# EasyEDA Pro project 2025_07_18_imu.epro

# Schematic Schematic1
Board Name: Board1; Create Date: 2025-07-18; Page Name: P1; Project Name: 2025_07_18_imu; Schematic Name: Schematic1; Update Date: 2025-07-18; Company: EasyEDA.com; Page Size: A4; Version: V1.0
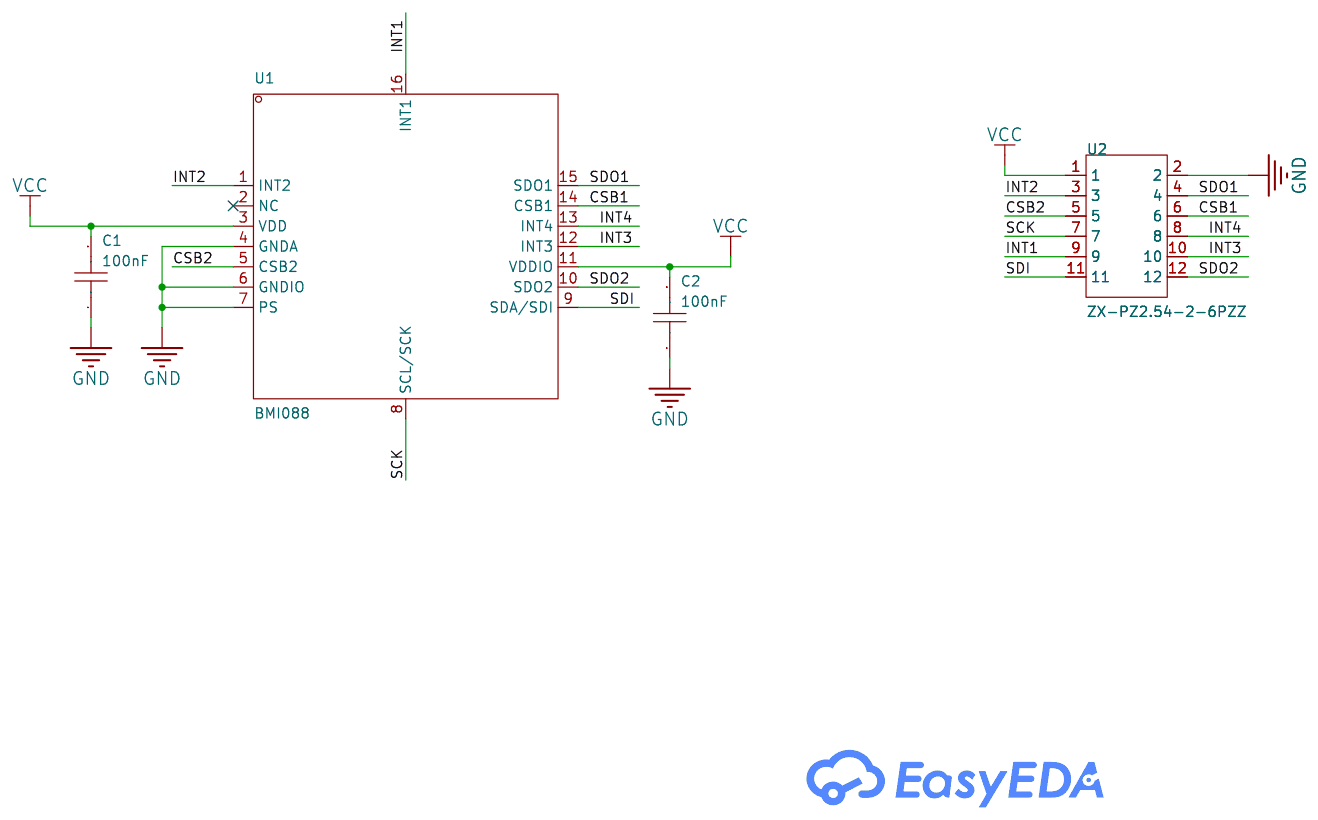
[diagram p0: schematic sheet]

## Parts
C1  100nF  [C0402]
C2  100nF  [C0402]
U1  BMI088  [LGA-16_L4.5-W3.0-P0.50-BL]
U2  ZX-PZ2.54-2-6PZZ  [HDR-TH_12P-P2.54-V-M-R2-C6-S2.54]

## Library data of the parts
C1 C2 = CL05B104KO5NNNC: Capacitance: Tolerance:±10% Tolerance:±10% Voltage Rated: Temperature Coefficient:; LCSC Part Name: 100nF ±10% 16V; Supplier Part: C1525; Manufacturer: SAMSUNG(三星); Supplier Footprint: 0402; JLCPCB Part Class: Basic Part; Datasheet: https://atta.szlcsc.com/upload/public/pdf/source/20160218/1457707763339.pdf; Supplier: LCSC; Tolerance: ±10%
U1 = BMI088: Sensor Type:加速度计陀螺仪 Operating Temperature:-40℃~+85℃ Operating Temperature:-40℃~+85℃; Supplier Part: C194919; Manufacturer: Bosch(博世); Supplier Footprint: LGA-16(3x4.5); JLCPCB Part Class: Extended Part; Datasheet: https://atta.szlcsc.com/upload/public/pdf/source/20180628/C194919_66CCF125FF968C218A4D358C68AC68D6.pdf; Supplier: LCSC; Sensor Type: 加速度计陀螺仪; Operating Temperature: -40℃~+85℃
U2 = ZX-PZ2.54-2-6PZZ: Pin Structure:2x6P Pitch:2.54mm Row Spacing:2.54mm Circluar Pins/Square Pins:Policy Mounting Type:Straight Number of Rows:Double Row Number of Pins:12P Current Rating:3A Voltage Rating (Max):1kV Length of Mating Pin:6mm Insulation Height:2.5mm Length of E; LCSC Part Name: 2x6P 间距:2.54mm 方针 直插; Supplier Part: C7501277; Manufacturer: Megastar(兆星); Supplier Footprint: 插件,P=2.54mm; JLCPCB Part Class: Extended Part; Datasheet: https://atta.szlcsc.com/upload/public/pdf/source/20231122/7E8446F7D73762EB4E85E59BCD5E7B5B.pdf; Supplier: LCSC; Pin Structure: 2x6P; Pitch: 2.54mm; Row Spacing: 2.54mm; Circluar Pins/Square Pins: Policy; Mounting Type: Straight; Number of Rows: Double Row; Number of Pins: 12P; Current Rating: 3A; Voltage Rating (Max): 1kV; Length of Mating Pin: 6mm; Insulation Height: 2.5mm; Length of End Connection Pin: 3mm; Contact Material: Brass; Contact Plating: Gold; Operating Temperature: -40℃~+105℃; Color: Black

## Nets
GND: C1.1 C2.1 U1.4(GNDA) U1.6(GNDIO) U1.7(PS) U2.2
VCC: C1.2 C2.2 U1.3(VDD) U1.11(VDDIO) U2.1
CSB1: U1.14(CSB1) U2.6
CSB2: U1.5(CSB2) U2.5
INT1: U1.16(INT1) U2.9
INT2: U1.1(INT2) U2.3
INT3: U1.12(INT3) U2.10
INT4: U1.13(INT4) U2.8
SCK: U1.8(SCL/SCK) U2.7
SDI: U1.9(SDA/SDI) U2.11
SDO1: U1.15(SDO1) U2.4
SDO2: U1.10(SDO2) U2.12

Not connected (* = marked no-connect by the designer): U1 2(NC)*

# Board PCB1
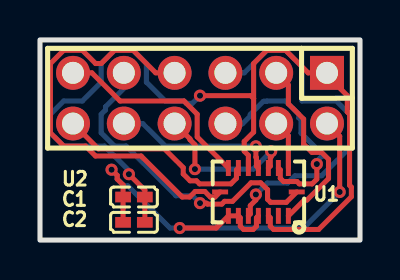
[diagram p1: board, top side]
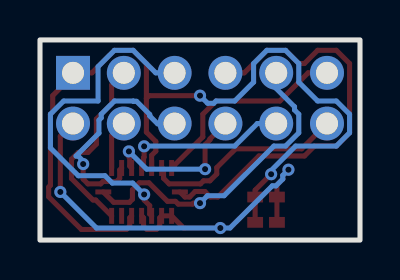
[diagram p2: board, bottom side, seen from below]

Outline 16 x 10.03 mm; copper layers: Top Layer, Bottom Layer. Coordinates in mm from the lower left corner of the outline.
Outline path: rectangle 0,10.03 16,0
Stack: Top Layer 0.035mm / Dielectric1 1.51mm FR4 er 4.5 / Bottom Layer 0.035mm

## Design rules (mm)
template: JLCPCB Capability(Two Layers Board)
spacing copperThickness1oz (default): track to track 0.102, other pairs 0.152 to 0.3
spacing copperThickness2oz: track to track 0.203, other pairs 0.152 to 0.3
track width copperThickness1oz (default): min 0.127, default 0.254, max 2.54
track width copperThickness2oz: min 0.203, default 0.254, max 2.54
differential pair differentialPair (default): width min 0.127, default 0.254, max 2.54; gap min 0.152, default 0.152
via viaSize (default): diameter min 0.5, default 0.61, max 10; hole min 0.3, default 0.305, max 6.3

## Placement (name value [footprint] x y rotation side)
C1  100nF  [C0402]  4.7 2.16 0 top
C2  100nF  [C0402]  4.7 0.89 0 top
U1  BMI088  [LGA-16_L4.5-W3.0-P0.50-BL]  10.92 2.41 90 top
U2  ZX-PZ2.54-2-6PZZ  [HDR-TH_12P-P2.54-V-M-R2-C6-S2.54]  8 7.11 180 top

## Footprints (pads in the part's own frame, mm; a bottom-side part is the same pattern mirrored in y, then rotated)
C0402
  rect 0.79x0.54 smd: 1(-0.545,0) 2(0.545,0)
HDR-TH_12P-P2.54-V-M-R2-C6-S2.54
  rect 1.7x1.7 hole 1.1: 1(-6.35,-1.27)
  round 1.7 hole 1.1: 2(-6.35,1.27) 3(-3.81,-1.27) 4(-3.81,1.27) 5(-1.27,-1.27) 6(-1.27,1.27) 7(1.27,-1.27) 8(1.27,1.27) 9(3.81,-1.27) 10(3.81,1.27) 11(6.35,-1.27) 12(6.35,1.27)
LGA-16_L4.5-W3.0-P0.50-BL
  rect 0.8x0.25 smd: 1(-1.2,-1.498) 2(-1.2,-0.998) 3(-1.2,-0.498) 4(-1.2,0.002) 5(-1.2,0.502) 6(-1.2,1.002) 7(-1.2,1.502) 9(1.2,1.502) 10(1.2,1.002) 11(1.2,0.502) 12(1.2,0.002) 13(1.2,-0.498) 14(1.2,-0.998) 15(1.2,-1.498)
  rect 0.25x0.8 smd: 8(0,1.915) 16(0,-1.915)

## Nets
As in the schematic.

Pads without a net: U1 2

## Via types
v1: diameter 0.61, hole 0.305, Top Layer to Bottom Layer, 11 vias

## Routing (per net, layer and track width the routed paths; a pad name or vN(x,y) marks a point on that pad's centre or on a via; arc(x,y) is an arc through that point)
GND: length 25.3
  Top Layer w0.254: U1.4 10.87,1.17 10.87,1.16 10.82,1.11 10.82,0.7 10.66,0.53 10.18,0.53 10.02,0.7 10.02,1.12 U1.6 U1.7 8.81,0.61 v1(6.99,0.61) ; v1(14.99,2.41) 14.99,5.21 U2.2 ; v1(3.58,3.53) 3.86,3.25 3.86,3.06 4.15,2.77 C1.1 C2.1
  Bottom Layer w0.254: v1(14.99,2.41) 13.18,0.61 v1(6.99,0.61) 6.5,0.61 4.39,2.72 4.2,2.72 3.86,3.06 3.86,3.25 v1(3.58,3.53)
VCC: length 44.5
  Top Layer w0.254: 10.68,7.1 10.68,8.85 11.34,9.51 12.28,9.51 13.41,8.38 U2.1 14.35,8.25 15.37,7.24 15.37,6.42 15.48,6.31 15.48,2.75 15.57,2.66 15.57,2.17 13.93,0.53 11.68,0.53 11.52,0.7 11.52,1.12 U1.3 ; 10.68,7.1 10.54,7.24 v1(8,7.24) ; 10.68,7.1 10.68,5.41 10.21,4.94 10.21,4.46 10.42,4.25 U1.11 ; v1(4.44,3.3) 5.24,2.5 C1.2 C2.2
  Bottom Layer w0.254: v1(8,7.24) 7.62,6.86 7.31,6.86 7.2,6.97 6.26,6.97 5.32,7.91 5.32,8.85 4.66,9.51 3.72,9.51 3.06,8.85 3.06,7.91 2.12,6.97 1.18,6.97 0.52,6.31 0.52,5.37 1.18,4.71 3.22,4.71 4.44,3.49 v1(4.44,3.3)
CSB1: length 11
  Top Layer w0.254: U1.14 12.02,3.52 12.02,3.1 12.18,2.93 12.85,2.93 12.97,2.82 13.61,2.82 13.84,3.05 v1(13.84,3.81)
  Bottom Layer w0.254: v1(13.84,3.81) 13.84,3.96 14.1,4.22 14.2,4.22 13.05,5.36 13.05,6.01 12.94,6.13 12.94,6.31 12.28,6.97 11.34,6.97 11.33,6.96 11.18,6.96 10.51,6.29 10.51,6.22 10.12,5.83 9.29,5.83 U2.6
CSB2: length 17.6
  Top Layer w0.254: v1(10.79,2.29) 10.79,2.01 10.52,1.73 10.52,1.31 U1.5
  Bottom Layer w0.254: v1(10.79,2.29) 11.37,2.86 12.38,2.86 12.75,3.23 14.09,3.23 15.48,4.62 15.48,6.31 14.82,6.97 13.1,6.97 13.1,8.69 12.28,9.51 11.34,9.51 10.21,8.38 U2.5
INT1: length 16.3
  Top Layer w0.254: v1(8,1.85) 8.32,1.85 8.37,1.8 9.09,1.8 9.23,1.94 9.63,1.94 10.55,2.87 11.04,2.87 11.38,2.53 11.38,2.04 11.53,1.89 12.32,1.89 U1.16
  Bottom Layer w0.254: U2.9 4.4,8.17 4.4,7.81 3.27,6.68 3.27,6.52 3.06,6.31 3.06,5.37 3.72,4.71 4.31,4.71 6.8,2.22 7.63,2.22 v1(8,1.85)
INT2: length 9.4
  Top Layer w0.254: U1.1 13.22,2.01 13.35,2.01 14.43,3.08 14.43,4.05 14.09,4.39 13.6,4.39 13.18,4.81 13.18,6.07 12.42,6.83 12.42,7.77 U2.3
INT3: length 8.2
  Top Layer w0.254: v1(10.79,4.7) 10.79,4.16 10.82,4.13 10.82,3.71 U1.12
  Bottom Layer w0.254: U2.10 5.13,5.84 6.26,4.71 10.78,4.71 v1(10.79,4.7)
INT4: length 7.8
  Top Layer w0.254: v1(7.75,3.56) 7.75,4.78 7.5,5.03 7.5,5.07 U2.8 ; v1(11.56,4.45) 11.56,4.17 11.52,4.13 11.52,3.71 U1.13
  Bottom Layer w0.254: v1(7.75,3.56) 10.67,3.56 v1(11.56,4.45)
SCK: length 21.1
  Top Layer w0.254: U1.8 8.75,2.16 8.52,2.16 8.24,2.44 7.76,2.44 7.48,2.16 7.11,2.16 5.06,4.22 2.77,4.22 2.28,4.71 1.18,4.71 0.52,5.37 0.52,8.85 1.18,9.51 2.12,9.51 2.78,8.85 3.06,8.85 3.72,9.51 4.66,9.51 5.79,8.38 U2.7
SDI: length 10.4
  Top Layer w0.254: U1.9 7.86,5.17 7.86,6.31 7.2,6.97 4.01,6.97 2.59,8.38 U2.11
SDO1: length 2.5
  Top Layer w0.254: U2.4 12.42,5.23 U1.15
SDO2: length 10.3
  Top Layer w0.254: U1.10 9.82,3.52 9.82,3.1 9.54,2.82 7.98,2.82 7.82,2.97 7.5,2.97 7.16,3.31 7.16,3.63 6.22,4.57 2.92,4.57 U2.12
